# EAGLE design PCB_Grupo_1 (EAGLE 9.6.2)
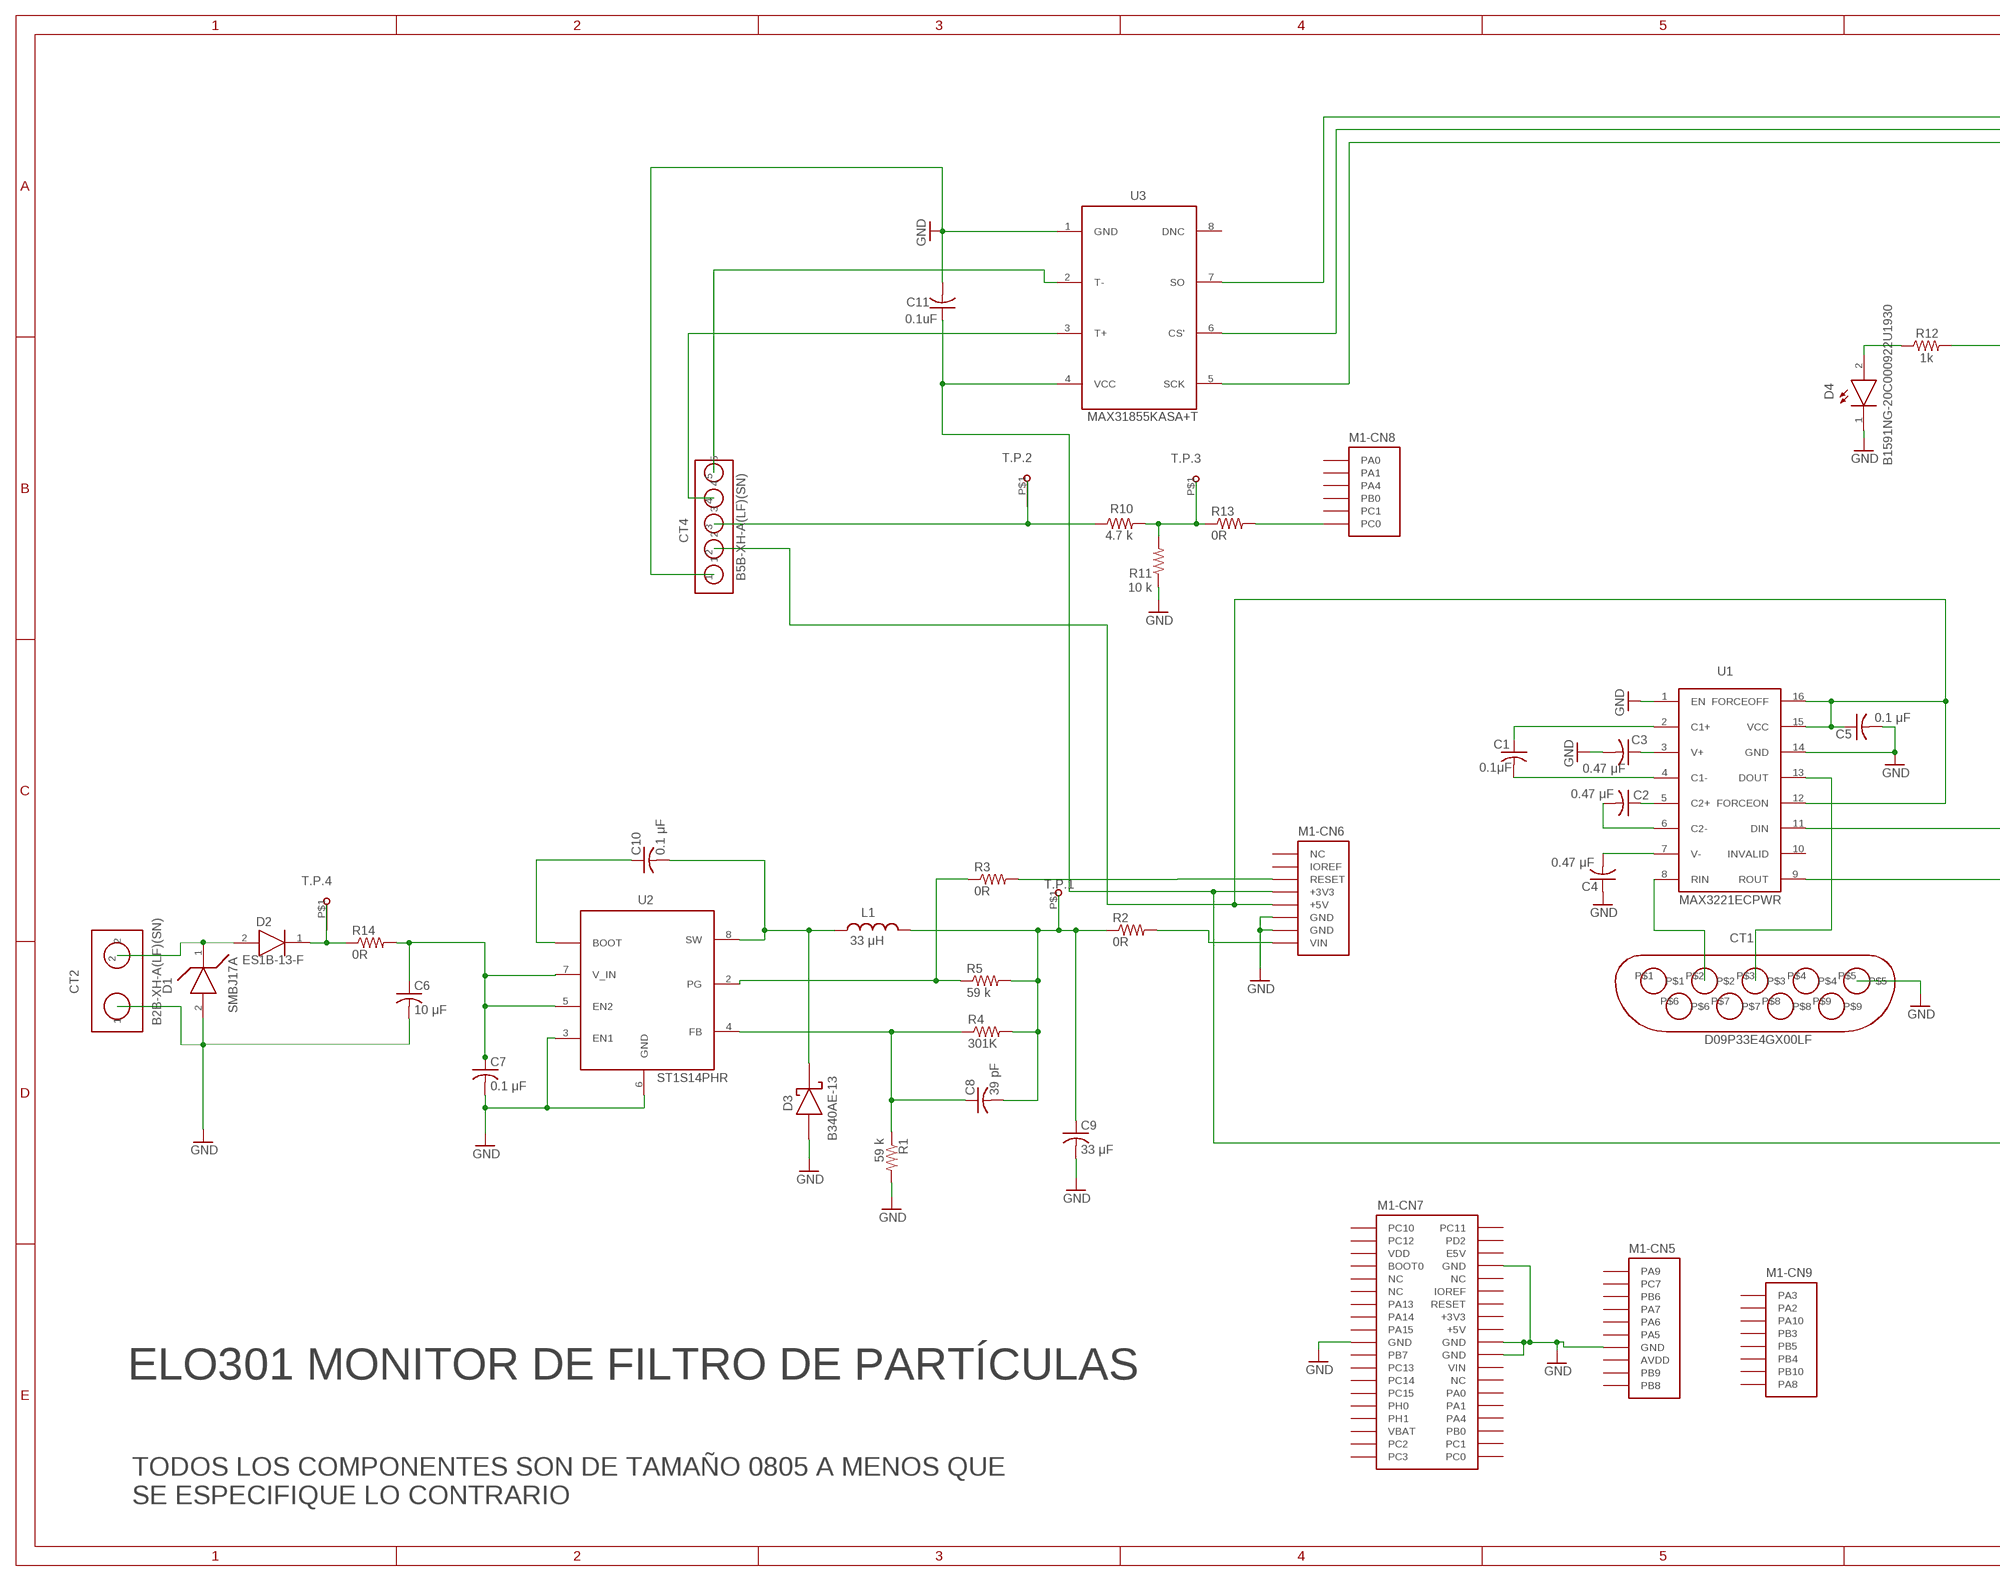
[diagram p0: schematic, sheet 1, part 1 of 2]
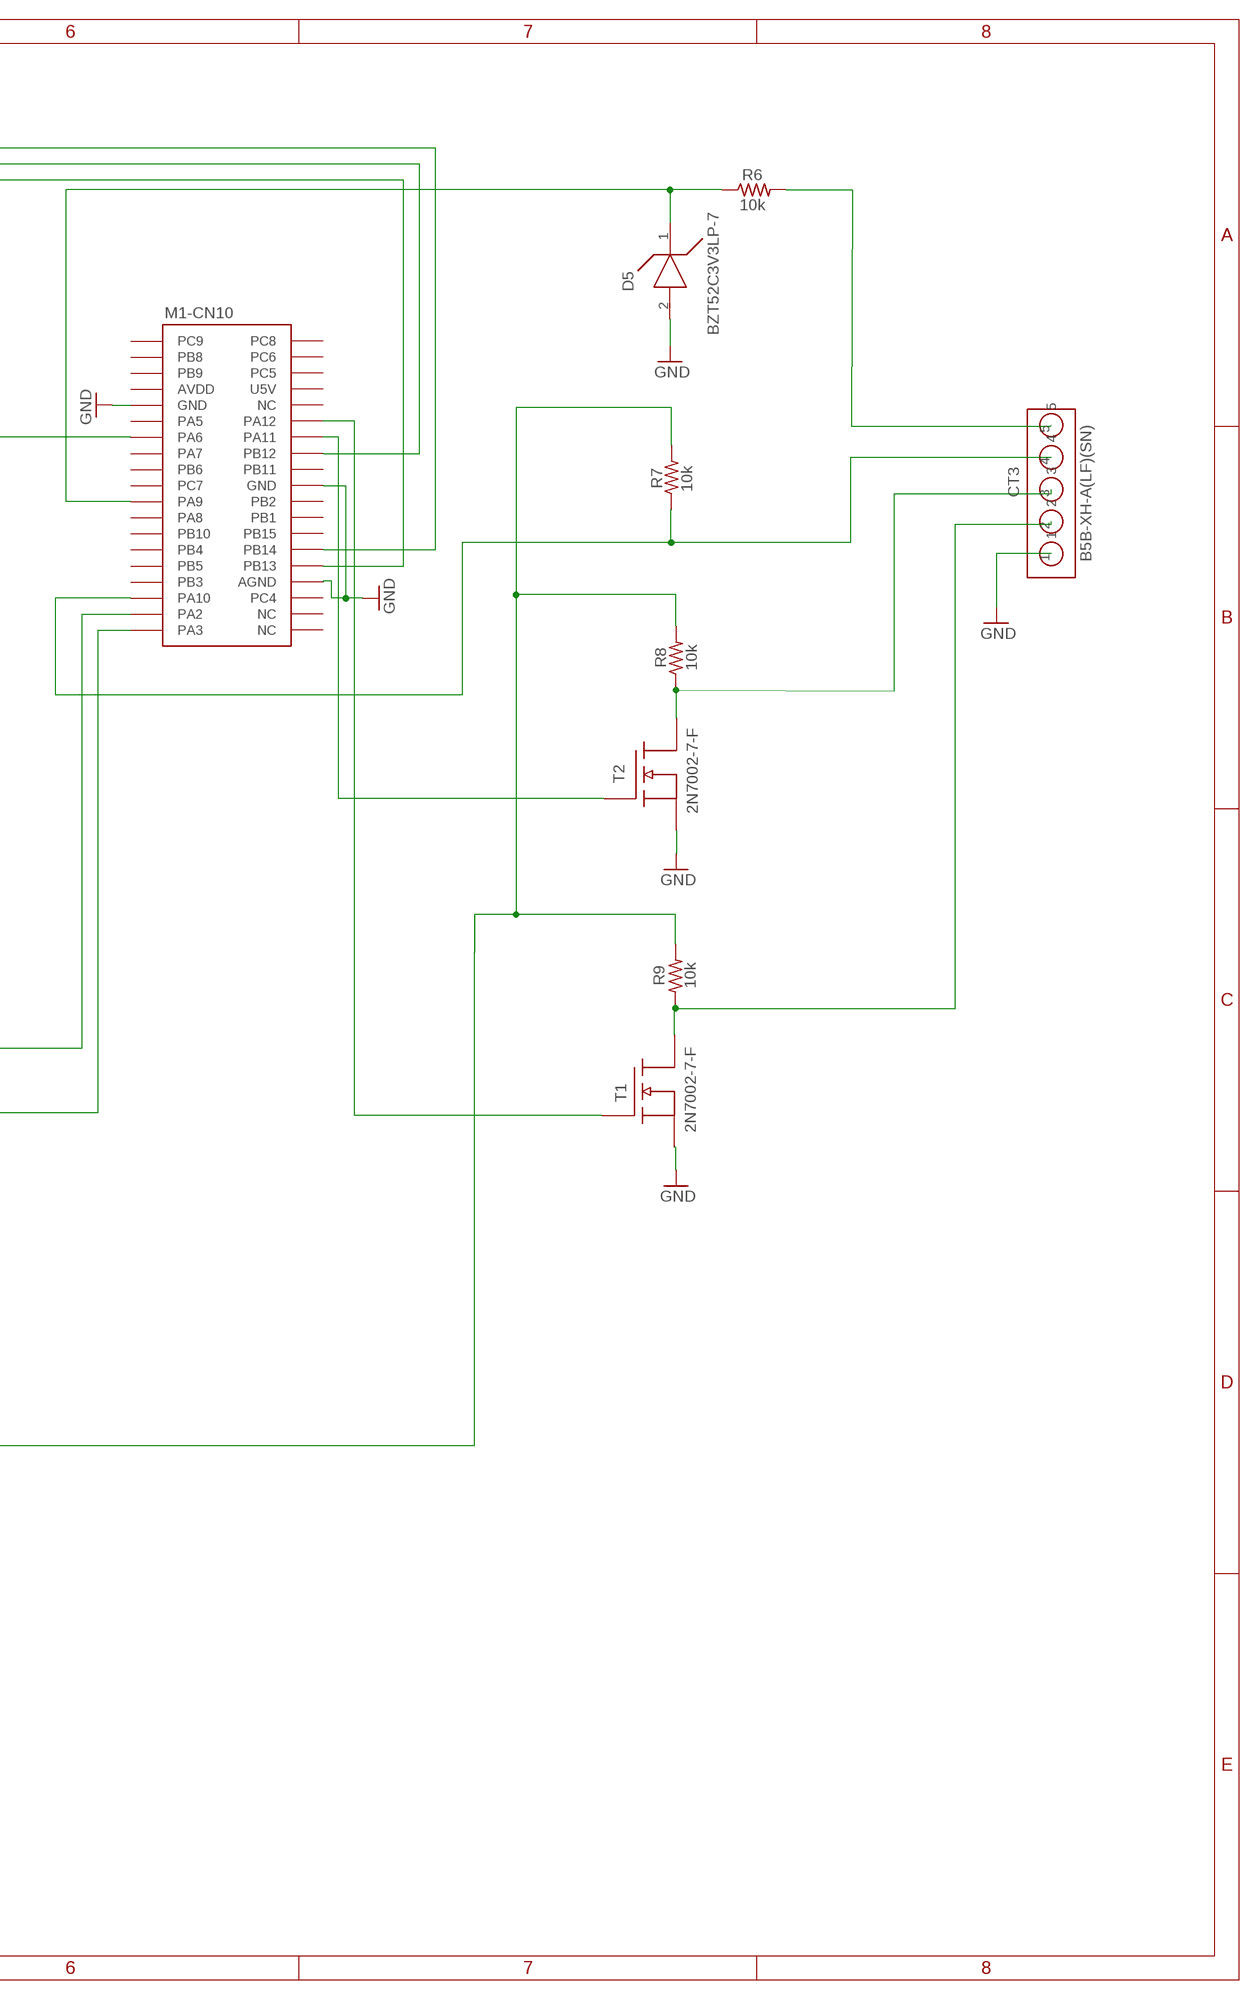
[diagram p1: schematic, sheet 1, part 2 of 2]

## Parts
C1  0.1μF  C-USC0805  [C0805]
C2  0.47 μF  C-USC0805  [C0805]
C3  0.47 μF  C-USC0805  [C0805]
C4  0.47 μF  C-USC0805  [C0805]
C5  0.1 μF  C-USC0805  [C0805]
C6  10 μF  C-USC0805  [C0805]
C7  0.1 μF  C-USC0805  [C0805]
C8  39 pF  C-USC0805  [C0805]
C9  33 μF  C-USC0805  [C0805]
C10  0.1 μF  C-USC0805  [C0805]
C11  0.1uF  C-USC0805  [C0805]
CT1  D09P33E4GX00LF  [JEDEC]
CT2  B2B-XH-A(LF)(SN)  [2-PIN-XH-JST]
CT3  B5B-XH-A(LF)(SN)  [5-PIN-JST]
CT4  B5B-XH-A(LF)(SN)  [5-PIN-JST]
D1  SMBJ17A  [DO-214AA]
D2  ES1B-13-F  [DO-214AC]
D3  B340AE-13  B340AE-13-DI  [DO-214AC]
D4  B1591NG-20C000922U1930  B1591NG--20C000922U1930  [1206(3216METRIC)]
D5  BZT52C3V3LP-7  [0402]
L1  33 μH  LVS606045-330M-N  [SMD]
M1  NUCLEO-L452RE  [NUCLEO-64]
R1  59 k  R-US_R0805  [R0805]
R2  0R  R-US_R0805  [R0805]
R3  0R  R-US_R0805  [R0805]
R4  301K  R-US_R0805  [R0805]
R5  59 k  R-US_R0805  [R0805]
R6  10k  R-US_R0805  [R0805]
R7  10k  R-US_R0805  [R0805]
R8  10k  R-US_R0805  [R0805]
R9  10k  R-US_R0805  [R0805]
R10  4.7 k  R-US_R0805  [R0805]
R11  10 k  R-US_R0805  [R0805]
R12  1k  R-US_R0805  [R0805]
R13  0R  R-US_R0805  [R0805]
R14  0R  R-US_R0805  [R0805]
T1  2N7002-7-F  [TO-236-3]
T2  2N7002-7-F  [TO-236-3]
T.P.1  TEST_POINT  [T.P.]
T.P.2  TEST_POINT  [T.P.]
T.P.3  TEST_POINT  [T.P.]
T.P.4  TEST_POINT  [T.P.]
U1  MAX3221ECPWR  [TSSOP]
U2  ST1S14PHR  [8-SOIC]
U3  MAX31855KASA+T  [8-SOIC]

## Nets
GND: C3.2 C4.1 C5.2 C6.2 C7.2 C9.2 C11.2 CT1.P$5 CT2.1 CT3.1 CT4.1 D1.2(A) D3.2(ANODO) D4.1(C) D5.2(A) M1.CN5-7(-CN5:GND) M1.CN6-6(-CN6:GND) M1.CN6-7(-CN6:GND) M1.CN7-8(-CN7:GND) M1.CN7-19(-CN7:GND) M1.CN7-20(-CN7:GND) M1.CN7-22(-CN7:GND) M1.CN10-9(-CN10:GND) M1.CN10-20(-CN10:GND) M1.CN10-32(-CN10:AGND) R1.2 R11.1 T1.S(SOURCE) T2.S(SOURCE) U1.1(EN) U1.14(GND) U2.3(EN1) U2.6(GND) U3.1(GND)
N$1: C1.1 U1.2(C1+)
N$2: C3.1 U1.3(V+)
N$3: C1.2 U1.4(C1-)
N$4: C2.1 U1.5(C2+)
N$5: C2.2 U1.6(C2-)
N$6: C4.2 U1.7(V-)
N$7: CT1.P$2 U1.8(RIN)
N$8: C5.1 CT4.2 M1.CN6-5(-CN6:+5V) U1.12(FORCEON) U1.15(VCC) U1.16(FORCEOFF)
N$9: CT1.P$3 U1.13(DOUT)
N$10: CT2.2 D1.1(C) D2.2(A)
N$11: C6.1 C7.1 R14.2 U2.5(EN2) U2.7(V_IN)
N$12: C10.1 U2.1(BOOT)
N$13: C10.2 D3.1(CATODO) L1.1 U2.8(SW)
N$14: C8.1 R1.1 R4.1 U2.4(FB)
N$15: C8.2 C9.1 L1.2 R2.1 R4.2 R5.2 T.P.1.P$1(T.P.)
N$16: R3.1 R5.1 U2.2(PG)
N$17: M1.CN6-3(-CN6:RESET) R3.2
N$18: M1.CN6-8(-CN6:VIN) R2.2
N$19: M1.CN10-14(-CN10:PA11) T2.G(GATE)
N$20: CT3.4 M1.CN10-33(-CN10:PA10) R7.1
N$21: M1.CN10-12(-CN10:PA12) T1.G(GATE)
N$22: CT3.5 R6.2
N$23: D5.1(C) M1.CN10-21(-CN10:PA9) R6.1
N$24: CT3.3 R8.1 T2.D(DRAIN)
N$25: D4.2(A) R12.1
N$26: C11.1 M1.CN6-4(-CN6:+3V3) R7.2 R8.2 R9.2 U3.4(VCC)
N$27: CT3.2 R9.1 T1.D(DRAIN)
N$28: CT4.4 U3.3(T+)
N$29: CT4.5 U3.2(T-)
N$30: M1.CN10-28(-CN10:PB14) U3.7(SO)
N$31: M1.CN10-16(-CN10:PB12) U3.6(CS')
N$32: M1.CN10-30(-CN10:PB13) U3.5(SCK)
N$33: M1.CN10-35(-CN10:PA2) U1.11(DIN)
N$34: R10.2 R11.2 R13.1 T.P.3.P$1(T.P.)
N$35: M1.CN10-37(-CN10:PA3) U1.9(ROUT)
N$36: M1.CN10-13(-CN10:PA6) R12.2
N$37: M1.CN8-6(-CN8:PC0) R13.2
N$38: CT4.3 R10.1 T.P.2.P$1(T.P.)
N$39: D2.1(C) R14.1 T.P.4.P$1(T.P.)
Unconnected: CT1.P$1 CT1.P$4 CT1.P$6 CT1.P$7 CT1.P$8 CT1.P$9 M1.CN5-1(-CN5:PA9) M1.CN5-2(-CN5:PC7) M1.CN5-3(-CN5:PB6) M1.CN5-4(-CN5:PA7) M1.CN5-5(-CN5:PA6) M1.CN5-6(-CN5:PA5) M1.CN5-9(-CN5:PB9) M1.CN5-10(-CN5:PB8) M1.CN6-1(-CN6:NC) M1.CN7-1(-CN7:PC10) M1.CN7-2(-CN7:PC11) M1.CN7-3(-CN7:PC12) M1.CN7-4(-CN7:PD2) M1.CN7-6(-CN7:E5V) M1.CN7-7(-CN7:BOOT0) M1.CN7-9(-CN7:NC) M1.CN7-10(-CN7:NC) M1.CN7-11(-CN7:NC) M1.CN7-12(-CN7:IOREF) M1.CN7-13(-CN7:PA13) M1.CN7-14(-CN7:RESET) M1.CN7-15(-CN7:PA14) M1.CN7-17(-CN7:PA15) M1.CN7-21(-CN7:PB7) M1.CN7-23(-CN7:PC13) M1.CN7-25(-CN7:PC14) M1.CN7-26(-CN7:NC) M1.CN7-27(-CN7:PC15) M1.CN7-28(-CN7:PA0) M1.CN7-29(-CN7:PH0) M1.CN7-30(-CN7:PA1) M1.CN7-31(-CN7:PH1) M1.CN7-32(-CN7:PA4) M1.CN7-34(-CN7:PB0) M1.CN7-35(-CN7:PC2) M1.CN7-36(-CN7:PC1) M1.CN7-37(-CN7:PC3) M1.CN7-38(-CN7:PC0) M1.CN8-1(-CN8:PA0) M1.CN8-2(-CN8:PA1) M1.CN8-3(-CN8:PA4) M1.CN8-4(-CN8:PB0) M1.CN8-5(-CN8:PC1) M1.CN9-1(-CN9:PA3) M1.CN9-2(-CN9:PA2) M1.CN9-3(-CN9:PA10) M1.CN9-4(-CN9:PB3) M1.CN9-5(-CN9:PB5) M1.CN9-6(-CN9:PB4) M1.CN9-7(-CN9:PB10) M1.CN9-8(-CN9:PA8) M1.CN10-1(-CN10:PC9) M1.CN10-2(-CN10:PC8) M1.CN10-3(-CN10:PB8) M1.CN10-4(-CN10:PC6) M1.CN10-5(-CN10:PB9) M1.CN10-6(-CN10:PC5) M1.CN10-10(-CN10:NC) M1.CN10-11(-CN10:PA5) M1.CN10-15(-CN10:PA7) M1.CN10-17(-CN10:PB6) M1.CN10-18(-CN10:PB11) M1.CN10-19(-CN10:PC7) M1.CN10-22(-CN10:PB2) M1.CN10-23(-CN10:PA8) M1.CN10-24(-CN10:PB1) M1.CN10-25(-CN10:PB10) M1.CN10-26(-CN10:PB15) M1.CN10-27(-CN10:PB4) M1.CN10-29(-CN10:PB5) M1.CN10-31(-CN10:PB3) M1.CN10-34(-CN10:PC4) M1.CN10-36(-CN10:NC) M1.CN10-38(-CN10:NC) U1.10(INVALID) U3.8(DNC)

## Notes on the sheet
- ELO301 MONITOR DE FILTRO DE PARTÍCULAS
- TODOS LOS COMPONENTES SON DE TAMAÑO 0805 A MENOS QUE 
  SE ESPECIFIQUE LO CONTRARIO

## Power pins joined to a net without a drawn wire
+3V3: M1.CN7-16(-CN7:+3V3)
+5V: M1.CN7-18(-CN7:+5V)
AVDD: M1.CN5-8(-CN5:AVDD) M1.CN10-7(-CN10:AVDD)
IOREF: M1.CN6-2(-CN6:IOREF)
U5V: M1.CN10-8(-CN10:U5V)
VBAT: M1.CN7-33(-CN7:VBAT)
VDD: M1.CN7-5(-CN7:VDD)
VIN: M1.CN7-24(-CN7:VIN)

## Library data of the parts
C1 C5 = rcl:C-US: CAPACITOR, American symbol; PARTNO: GCM21BR72A104KA37L; SPICEPREFIX: C
C2-C4 = rcl:C-US: CAPACITOR, American symbol; PARTNO: GCM21BR71H474KA55L; SPICEPREFIX: C
C6 = rcl:C-US: CAPACITOR, American symbol; PART_NO: GRM21BR61H106KE43L; SPICEPREFIX: C
C7 C10 C11 = rcl:C-US: CAPACITOR, American symbol; PART_NO: GCM21BR72A104KA37L; SPICEPREFIX: C
C8 = rcl:C-US: CAPACITOR, American symbol; PART_NO: GRM21A5C2E390JW01D; SPICEPREFIX: C
C9 = rcl:C-US: CAPACITOR, American symbol; PART_NO: GRM21BR60G336ME15L; SPICEPREFIX: C
CT1 = D09P33E4GX00LF_-_Amphenol_ICC_FCI_1:D09P33E4GX00LF; PART_NO: D09P33E4GX00LF
CT2 = B2B-XH-A(LF)(SN)-JST:B2B-XH-A(LF)(SN); PART_NO: B2B-XH-A(LF)(SN)
CT3 = B5B-XH-A(LF)(SN)-JST:B5B-XH-A(LF)(SN); PARTNO: B5B-XH-A(LF)(SN)
CT4 = B5B-XH-A(LF)(SN)-JST:B5B-XH-A(LF)(SN); PART_NO: B5B-XH-A(LF)(SN)
D1 = SMBJ17A:SMBJ17A; PART_NO: SMBJ17A
D2 = nacha_weaitas:ES1B-13-F; PART_NO: ES1B-13-F
D3 = nacha_weaitas:B340AE-13-DI; PART_NO: B340AE-13
D4 = B1591NG--20C000922U1930:B1591NG--20C000922U1930; PART_NO: B1591NG-20C000922U1930
D5 = SMBJ17A:BZT52C3V3LP-7; PART_NO: BZT52C3V3LP-7
L1 = LVS606045-330M-N - CHILISIN ELECTRONICS CORP:LVS606045-330M-N; PART_NO: LVS606045-330M-N
M1 = NUCLEO-L452RE:NUCLEO-L452RE: No existe un outline (Layer Dimension) para esta librería. En su lugar se utilizó una referencia en tDocu. Al momento de diseñar la tarjeta, el Dimension debe ser dibujado según los requerimientos del usuario, o simplemente copiar los contenidos del tDocu en Dimensions.
R1 R5 = rcl:R-US_: RESISTOR, American symbol; PART_NO: RC0805FR-0759KL; SPICEPREFIX: R
R2 R3 R13 R14 = rcl:R-US_: RESISTOR, American symbol; PART_NO: RC0805JR-070RL; SPICEPREFIX: R
R4 = rcl:R-US_: RESISTOR, American symbol; PARTNO: RC0805FR-07301KL; SPICEPREFIX: R
R6-R9 = rcl:R-US_: RESISTOR, American symbol; PARTNO: Y40227K34000T9W; SPICEPREFIX: R
R10 = rcl:R-US_: RESISTOR, American symbol; PART_NO: RC0805FR-074K7L; SPICEPREFIX: R
R11 = rcl:R-US_: RESISTOR, American symbol; PART_NO: RC0805FR-0710KL; SPICEPREFIX: R
R12 = rcl:R-US_: RESISTOR, American symbol; PART_NO: RC0805FR-071KL; SPICEPREFIX: R
T1 T2 = nacha_weaitas:2N7002-7-F; PART_NO: 2N7002-7-F
T.P.1-T.P.4 = TEST_POINT:TEST_POINT
U1 = MAX3221ECPWR-TI:MAX3221ECPWR; PART_NO: MAX3221ECPWR
U2 = nacha_weaitas:ST1S14PHR; PART_NO: ST1S14PHR
U3 = MAX31855KASA+T- MAXIM INTEGRATED:MAX31855KASA+T; PART_NO: MAX31855KASA+T

## Board
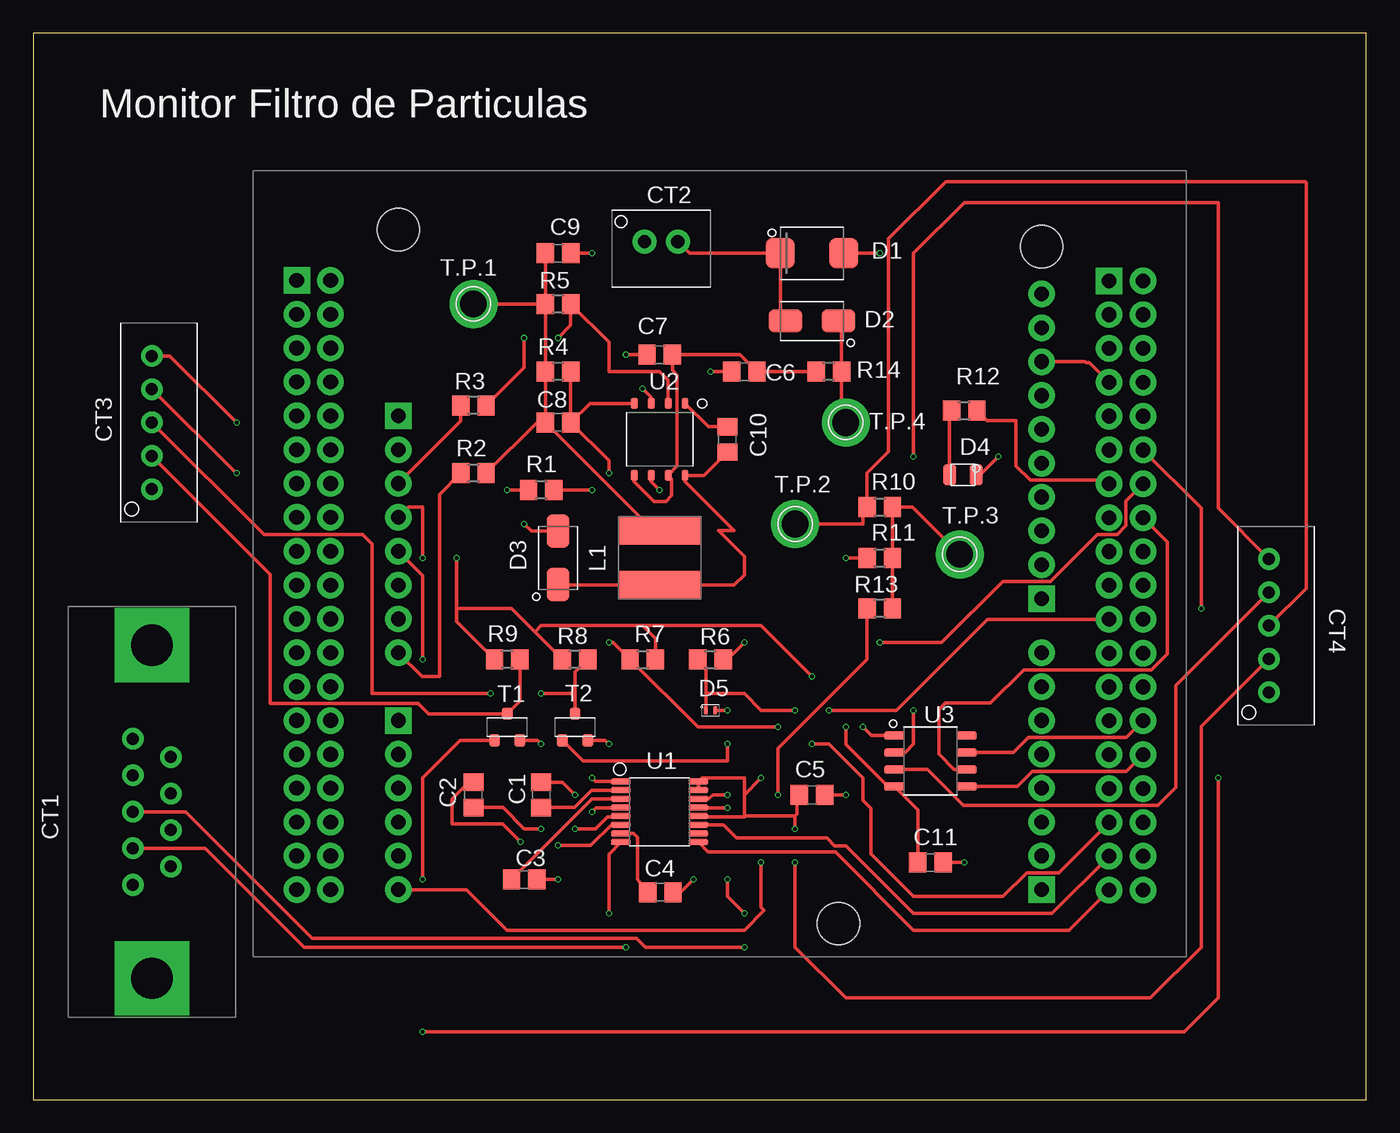
[diagram p2: board, top side]
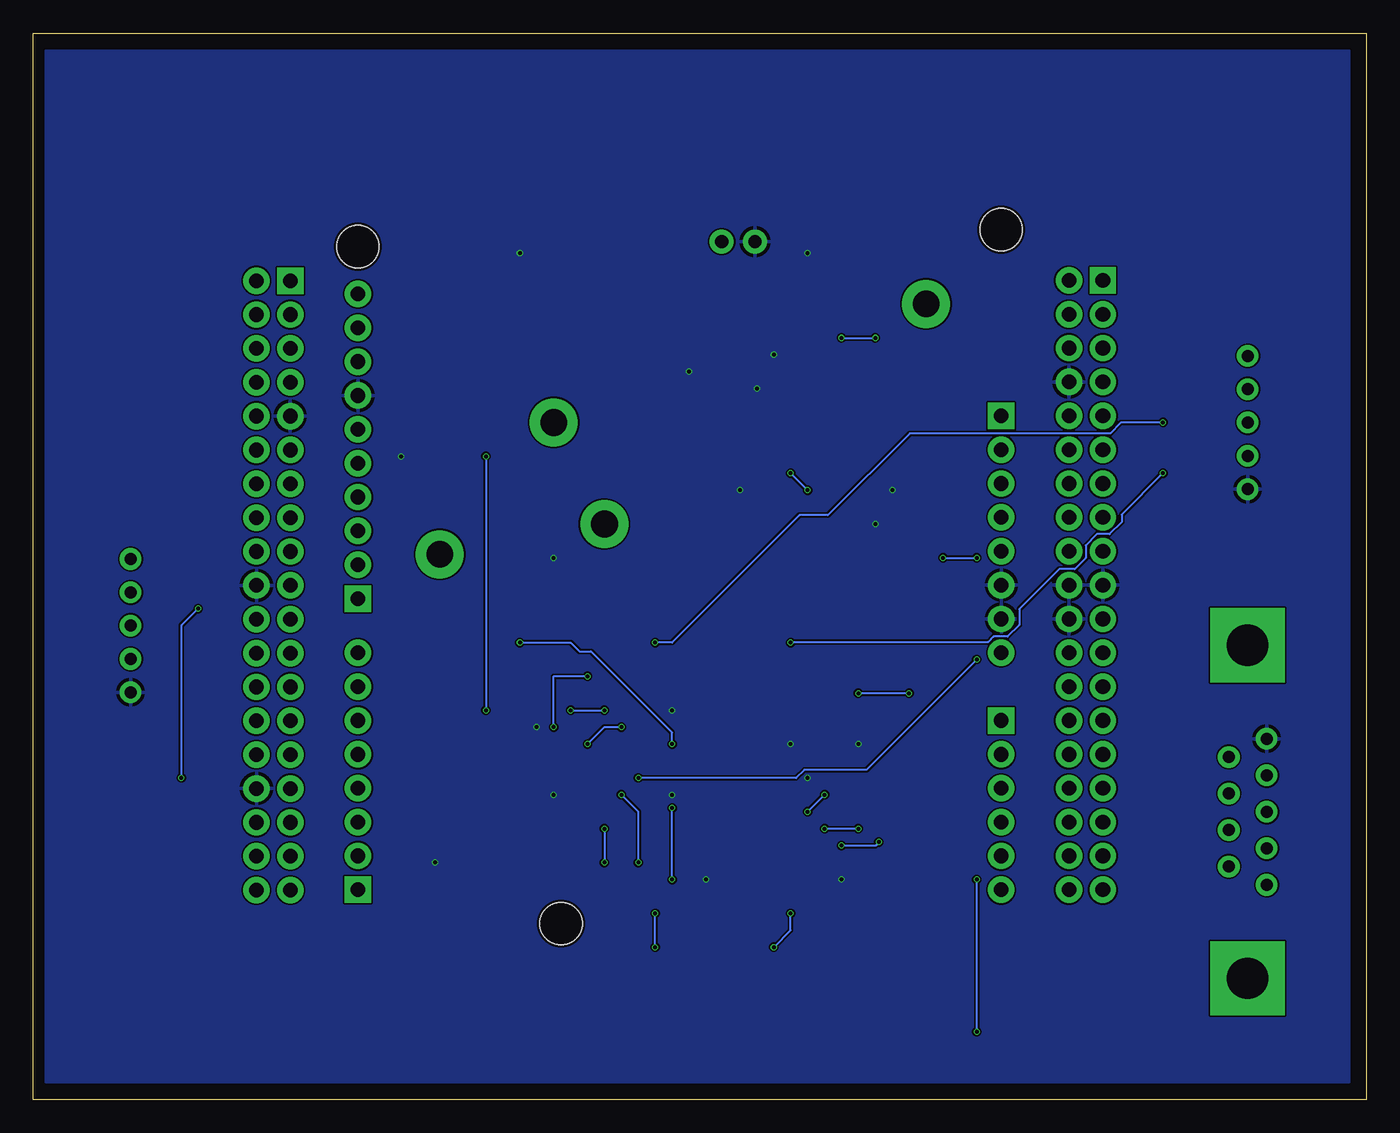
[diagram p3: board, bottom side, seen from below]

Size 100 x 80 mm. Coordinates in mm from the lower left corner, seen from the top.
Outline: 0,0 100,0 100,80 0,80 0,0
Copper layers (1*16): Top 0.035mm / dielectric 1.6mm / Bottom 0.035mm
Design rules "jlcpcb-2layers": minimum track width 5mil, minimum drill 0.3mm, track to track 5mil, track to pad 5mil, pad to pad 5mil, via to via 5mil, smd to smd 5mil, copper to edge 0.2mm, drill to drill 6mil, minimum pad ring 10mil, minimum via ring 3mil, stop-mask expansion 4mil, vias tented up to drill 0mil, thermal gap 10mil

### Footprints (pad centres in the part's own frame; a part is rotated, then mirrored left to right if it is on the bottom)
C0805 = smd 1.3 x 1.5: 1 -0.95,0; 2 0.95,0
JEDEC = drill 0.9: P$1 -5.48,1.42; P$2 -2.74,1.42; P$3 0,1.42; P$4 2.74,1.42; P$5 5.48,1.42; P$6 -4.11,-1.42; P$7 -1.37,-1.42; P$8 1.37,-1.42; P$9 4.11,-1.42 | drill 3.1 square: P$10 12.495,0; P$11 -12.495,0
2-PIN-XH-JST = drill 1: 1 -1.25,0; 2 1.25,0
5-PIN-JST = drill 0.9: 1 -5,0; 2 -2.5,0; 3 0,0; 4 2.5,0; 5 5,0
DO-214AA = smd 2.159 x 2.261: 1 -2.375,0; 2 2.375,0
DO-214AC = smd 2.5 x 1.7: 1 -2,0; 2 2,0
1206(3216METRIC) = smd 1.6 x 1: 1 0,1; 2 0,-1
0402 = smd 0.3 x 0.6: 1 -0.35,0; 2 0.35,0
SMD = smd 6.2 x 2.1: 1 0,2.05; 2 0,-2.05
NUCLEO-64 = drill 1.1 pad 1.85 square: CN5-1 59.13,24.884; CN6-1 10.87,38.6; CN7-1 3.25,48.76; CN8-1 10.87,15.74; CN9-1 59.13,3.04; CN10-1 64.21,48.735 | drill 1.1 pad 1.85: CN5-2 59.13,27.424; CN5-3 59.13,29.964; CN5-4 59.13,32.504; CN5-5 59.13,35.044; CN5-6 59.13,37.584; CN5-7 59.13,40.124; CN5-8 59.13,42.664; CN5-9 59.13,45.204; CN5-10 59.13,47.744; CN6-2 10.87,36.06; CN6-3 10.87,33.52; CN6-4 10.87,30.98; CN6-5 10.87,28.44; CN6-6 10.87,25.9; CN6-7 10.87,23.36; CN6-8 10.87,20.82; CN7-2 5.79,48.76; CN7-3 3.25,46.22; CN7-4 5.79,46.22; CN7-5 3.25,43.68; CN7-6 5.79,43.68; CN7-7 3.25,41.14; CN7-8 5.79,41.14; CN7-9 3.25,38.6; CN7-10 5.79,38.6; CN7-11 3.25,36.06; CN7-12 5.79,36.06; CN7-13 3.25,33.52; CN7-14 5.79,33.52; CN7-15 3.25,30.98; CN7-16 5.79,30.98; CN7-17 3.25,28.44; CN7-18 5.79,28.44; CN7-19 3.25,25.9; CN7-20 5.79,25.9; CN7-21 3.25,23.36; CN7-22 5.79,23.36; CN7-23 3.25,20.82; CN7-24 5.79,20.82; CN7-25 3.25,18.28; CN7-26 5.79,18.28; CN7-27 3.25,15.74; CN7-28 5.79,15.74; CN7-29 3.25,13.2; CN7-30 5.79,13.2; CN7-31 3.25,10.66; CN7-32 5.79,10.66; CN7-33 3.25,8.12; CN7-34 5.79,8.12; CN7-35 3.25,5.58; CN7-36 5.79,5.58; CN7-37 3.25,3.04; CN7-38 5.79,3.04; CN8-2 10.87,13.2; CN8-3 10.87,10.66; CN8-4 10.87,8.12; CN8-5 10.87,5.58; CN8-6 10.87,3.04; CN9-2 59.13,5.58; CN9-3 59.13,8.12; CN9-4 59.13,10.66; CN9-5 59.13,13.2; CN9-6 59.13,15.74; CN9-7 59.13,18.28; CN9-8 59.13,20.82; CN10-2 66.75,48.735; CN10-3 64.21,46.195; CN10-4 66.75,46.195; CN10-5 64.21,43.655; CN10-6 66.75,43.655; CN10-7 64.21,41.115; CN10-8 66.75,41.115; CN10-9 64.21,38.575; CN10-10 66.75,38.575; CN10-11 64.21,36.035; CN10-12 66.75,36.035; CN10-13 64.21,33.495; CN10-14 66.75,33.495; CN10-15 64.21,30.955; CN10-16 66.75,30.955; CN10-17 64.21,28.415; CN10-18 66.75,28.415; CN10-19 64.21,25.875; CN10-20 66.75,25.875; CN10-21 64.21,23.335; CN10-22 66.75,23.335; CN10-23 64.21,20.795; CN10-24 66.75,20.795; CN10-25 64.21,18.255; CN10-26 66.75,18.255; CN10-27 64.21,15.715; CN10-28 66.75,15.715; CN10-29 64.21,13.175; CN10-30 66.75,13.175; CN10-31 64.21,10.635; CN10-32 66.75,10.635; CN10-33 64.21,8.095; CN10-34 66.75,8.095; CN10-35 64.21,5.555; CN10-36 66.75,5.555; CN10-37 64.21,3.015; CN10-38 66.75,3.015 | hole 3.175: 59.13,51.3; 10.87,52.57; 43.89,0.5
R0805 = smd 1.3 x 1.5: 1 -0.95,0; 2 0.95,0
TO-236-3 = smd 0.8 x 0.9: D 0,1; G -0.95,-1; S 0.95,-1
T.P. = drill 2: P$1 0,0
TSSOP = smd 1.5 x 0.45: 1 -2.9,2.275; 2 -2.9,1.625; 3 -2.9,0.975; 4 -2.9,0.325; 5 -2.9,-0.325; 6 -2.9,-0.975; 7 -2.9,-1.625; 8 -2.9,-2.275; 9 2.9,-2.275; 10 2.9,-1.625; 11 2.9,-0.975; 12 2.9,-0.325; 13 2.9,0.325; 14 2.9,0.975; 15 2.9,1.625; 16 2.9,2.275
8-SOIC = smd 0.8 x 0.51: 1 -2.7,1.905; 2 -2.7,0.635; 3 -2.7,-0.635; 4 -2.7,-1.905; 5 2.7,-1.905; 6 2.7,-0.635; 7 2.7,0.635; 8 2.7,1.905
8-SOIC' = smd 1.549 x 0.61: 1 -2.705,1.905; 2 -2.705,0.635; 3 -2.705,-0.635; 4 -2.705,-1.905; 5 2.705,-1.905; 6 2.705,-0.635; 7 2.705,0.635; 8 2.705,1.905

### Placement (x,y rotation side)
C1  38.1,22.86 90 top
C2  33.02,22.86 90 top
C3  36.83,16.51 0 top
C4  47.04,15.55 180 top
C5  58.42,22.86 0 top
C6  53.34,54.61 180 top
C7  46.99,55.88 180 top
C8  39.37,50.8 180 top
C9  39.37,63.5 0 top
C10  52.07,49.53 270 top
C11  67.31,17.78 0 top
CT1  8.89,21.59 90 top
CT2  47.11,64.37 0 top
CT3  8.89,50.8 90 top
CT4  92.71,35.56 90 top
D1  58.42,63.5 0 top
D2  58.42,58.42 180 top
D3  39.37,40.64 90 top
D4  69.74,46.87 270 top
D5  50.8,29.21 0 top
L1  46.99,40.64 180 top
M1  16.51,12.7 0 top
R1  38.1,45.72 180 top
R2  33.02,46.99 180 top
R3  33.02,52.07 180 top
R4  39.37,54.61 180 top
R5  39.37,59.69 180 top
R6  50.8,33.02 0 top
R7  45.72,33.02 0 top
R8  40.64,33.02 180 top
R9  35.56,33.02 180 top
R10  63.5,44.45 0 top
R11  63.5,40.64 0 top
R12  69.85,51.69 0 top
R13  63.5,36.83 180 top
R14  59.69,54.61 180 top
T1  35.56,27.94 0 top
T2  40.64,27.94 0 top
T.P.1  33.02,59.69 180 top
T.P.2  57.15,43.18 0 top
T.P.3  69.51,40.91 0 top
T.P.4  60.96,50.8 180 top
U1  46.99,21.59 0 top
U2  46.99,49.53 270 top
U3  MAX31855KASA+T  [8-SOIC']  67.31,25.4 0 top

### Tracks (layer width: path | path; a pad name or v marks a point on that pad's centre or on a via)
AVDD
  Top 0.254: M1.CN5-8 78.89,55.36 78.96,55.3 79.24,55.3 M1.CN10-7
GND  (via drill 0.3)
  Top 0.254: C9.2 v41.91,63.5 | C7.2 v44.45,55.88 | C6.2 v50.8,54.61 | v63.5,63.5 D1.2 | U2.6 46.35,46.35 v46.99,45.72 | R1.2 v35.56,45.72 | U2.3 46.35,52.7 v45.72,53.34 | D3.2 37.37,42.64 v36.83,43.18 | D4.1 71,46.87 v72.39,48.26 | R11.1 v60.96,40.64 | U3.1 62.87,27.3 v62.23,27.94 | C11.2 v69.85,17.78 | v60.96,22.86 C5.2 | U1.14 49.91,22.54 50.66,22.54 50.98,22.86 v52.07,22.86 | D5.2 v52.07,29.21 | U1.1 42.17,23.86 v41.91,24.13 | T2.S 42.91,26.94 v43.18,26.67 | T1.S 37.83,26.94 v38.1,26.67 | v39.37,16.51 C3.2 | C4.1 48.57,15.55 v49.53,16.51
  pour Bottom: 1.27,1.27 99.06,1.27 99.06,78.74 1.27,78.74
N$1
  Top 0.254: C1.1 40.62,21.91 41.9,23.19 44.06,23.19 U1.2
N$2
  Top 0.254: C3.1 41.94,22.57 U1.3
N$3  (via drill 0.3)
  Top 0.254: C1.2 39.69,23.81 v40.64,22.86 | v41.91,21.59 42.21,21.89 42.96,21.89 42.94,21.87 44.04,21.87 U1.4
  Bottom 0.152: v40.64,22.86 v41.91,21.59
N$4  (via drill 0.3)
  Top 0.254: C2.1 35.24,21.91 36.83,20.32 v38.1,20.32 | U1.5 44.03,21.21 43.08,21.21 42.19,20.32 v40.64,20.32
  Bottom 0.152: v38.1,20.32 v40.64,20.32
N$5  (via drill 0.3)
  Top 0.254: C2.2 32.65,23.81 31.41,22.57 31.41,20.68 35.2,20.68 v36.56,19.32 | U1.6 44.07,20.64 43.4,20.64 41.82,19.06 v39.37,19.06
  Bottom 0.152: v36.56,19.32 36.83,19.05 v39.37,19.05 v39.37,19.06
N$6
  Top 0.254: C4.2 45.33,16.52 45.33,19.67 45.03,19.96 U1.7
N$7  (via drill 0.3)
  Top 0.254: CT1.P$2 12.9,18.85 20.32,11.43 v44.45,11.43 | v43.18,13.97 43.18,18.41 U1.8
  Bottom 0.152: v44.45,11.43 43.18,12.7 v43.18,13.97
N$8  (via drill 0.3)
  Top 0.254: C5.1 57.31,22.7 57.31,21.43 57.15,21.27 | 57.15,21.27 53.34,21.27 | U1.12 49.95,21.2 53.34,21.2 53.34,21.27 | 53.34,21.27 53.34,22.86 | 53.34,22.86 53.34,24.13 50.16,24.13 U1.16 U1.15 | CT4.2 87.63,27.98 87.63,11.43 83.82,7.62 60.96,7.62 57.15,11.43 v57.15,17.78 | v57.15,20.32 57.15,21.26 57.15,21.27 | M1.CN6-5 29.21,39.31 v29.21,33.02 | v54.61,24.13 53.34,22.86
  Bottom 0.152: v57.15,20.32 v57.15,17.78 | v54.61,24.13 42.77,24.13 42.16,24.74 37.49,24.74 v29.21,33.02
N$9  (via drill 0.3)
  Top 0.254: CT1.P$3 11.43,21.59 20.91,12.11 45.24,12.11 45.92,11.43 v53.34,11.43 | v53.34,13.97 52.07,15.24 v52.07,16.51 | v52.07,21.87 49.93,21.87 U1.13
  Bottom 0.152: v53.34,11.43 v53.34,13.97 | v52.07,16.51 v52.07,21.87
N$10
  Top 0.254: CT2.2 49.23,63.5 D1.1 56.05,58.8 D2.2
N$11
  Top 0.254: R14.2 C6.1 53.02,55.88 C7.1 47.94,54.74 48.31,54.37 48.31,47.51 U2.7 47.9,46.56 47.9,45.31 47.46,44.87 46.57,44.87 45.09,46.35 U2.5
N$12
  Top 0.254: C10.1 50.65,50.48 U2.1
N$13
  Top 0.254: C10.2 50.32,46.83 U2.8 48.9,46.35 52.55,42.7 51.39,42.7 53.34,40.75 53.34,39.37 52.56,38.59 L1.1 39.42,38.59 D3.1
N$14  (via drill 0.3)
  Top 0.254: C8.1 41.75,52.23 U2.4 | C8.1 43.18,47.94 v43.18,46.99 | v41.91,45.72 R1.1 | C8.1 R4.1
  Bottom 0.152: v43.18,46.99 v41.91,45.72
N$15
  Top 0.254: R5.2 T.P.1.P$1 | C9.1 R5.2 | R5.2 R4.2 C8.2 | R2.1 37.78,50.8 C8.2 | C8.2 46.53,42.69 L1.2
N$16  (via drill 0.3)
  Top 0.254: U2.2 47.62,53.98 46.99,54.61 43.18,54.61 43.18,56.83 R5.1 40.32,58.1 v39.37,57.15 | v36.83,57.15 36.83,54.93 R3.1
  Bottom 0.152: v39.37,57.15 v36.83,57.15
N$17
  Top 0.254: R3.2 32.07,50.91 M1.CN6-3
N$18
  Top 0.254: R2.2 30.48,45.4 30.48,31.75 29.15,31.75 M1.CN6-8
N$19  (via drill 0.3)
  Top 0.254: T2.G 41.23,25.4 52.07,25.4 v52.07,26.67 | v63.5,34.29 68.15,34.29 72.73,38.87 76.32,38.87 79.84,42.39 81.32,42.39 81.98,43.06 81.98,44.92 M1.CN10-14
  Bottom 0.152: v63.5,34.29 59.69,34.29 59.03,33.63 58.17,33.63 52.07,27.53 v52.07,26.67
N$20  (via drill 0.3)
  Top 0.254: v58.42,26.67 59.69,26.67 62.23,24.13 62.23,22.45 62.84,21.84 62.84,18.44 66.04,15.24 72.75,15.24 74.53,17.01 76.94,17.01 M1.CN10-33 | v55.88,27.94 49.85,27.94 R7.1 43.5,34.29 v43.18,34.29 | CT3.4 15.2,46.99 v15.24,46.99
  Bottom 0.152: v58.42,26.67 57.15,27.94 v55.88,27.94 | v15.24,46.99 18.35,43.88 18.35,43.32 19.25,42.41 20.21,42.41 21.04,41.59 21.04,40.64 21.88,39.8 23.03,39.8 26.04,36.8 26.04,35.62 26.91,34.74 27.97,34.74 28.36,34.35 43.12,34.35 v43.18,34.29
N$21  (via drill 0.3)
  Top 0.254: M1.CN10-12 87.63,44.37 v87.63,36.83 | v88.9,24.13 88.9,7.62 86.36,5.08 v29.21,5.08 | v29.21,16.51 29.21,24.13 32.02,26.94 T1.G
  Bottom 0.152: v87.63,36.83 88.9,35.56 v88.9,24.13 | v29.21,5.08 v29.21,16.51
N$22  (via drill 0.3)
  Top 0.254: CT3.5 10.24,55.8 v15.24,50.8 | v53.34,34.29 52.07,33.02 R6.2
  Bottom 0.152: v15.24,50.8 18.39,50.8 19.2,49.99 34.24,49.99 40.39,43.84 42.52,43.84 52.07,34.29 v53.34,34.29
N$23  (via drill 0.3)
  Top 0.254: D5.1 50.45,30.48 | 50.45,30.48 50.45,32.42 R6.1 | M1.CN10-21 71.59,36.03 64.77,29.21 v59.69,29.21 | v57.15,29.21 54.61,29.21 53.34,30.48 50.45,30.48
  Bottom 0.152: v59.69,29.21 v57.15,29.21
N$24  (via drill 0.3)
  Top 0.254: T2.D 40.64,30.48 | 40.64,30.48 40.64,32.07 R8.1 | v34.29,30.48 25.4,30.48 25.4,41.68 24.69,42.39 17.3,42.39 CT3.3 | v38.1,30.48 40.64,30.48
  Bottom 0.152: v34.29,30.48 v38.1,30.48
N$25
  Top 0.254: R12.1 68.74,51.53 D4.2
N$26  (via drill 0.3)
  Top 0.254: C11.1 66.36,21.74 U3.4 64.42,23.68 63.92,23.68 60.96,26.65 v60.96,27.94 | R9.2 31.75,35.88 31.75,36.83 | 31.75,36.83 v31.75,40.64 | v29.21,40.64 29.21,44.45 28.15,44.45 M1.CN6-4 | R8.2 37.62,35.09 | 37.62,35.09 35.88,36.83 31.75,36.83 | R7.2 46.67,34.61 45.72,35.56 | 45.72,35.56 38.1,35.56 37.62,35.09 | v58.42,31.75 54.61,35.56 45.72,35.56
  Bottom 0.152: v31.75,40.64 v29.21,40.64 | v60.96,27.94 60.96,31.75 v58.42,31.75
N$27
  Top 0.254: R9.1 36.51,29.89 T1.D 29.66,28.94 28.88,29.71 17.78,29.71 17.78,39.41 CT3.2
N$28
  Top 0.254: U3.3 67.1,24.77 69.78,22.08 84.38,22.08 85.71,23.41 85.71,31.06 CT4.4
N$29  (via drill 0.3)
  Top 0.254: CT4.5 88.9,44.37 88.9,67.31 69.85,67.31 66.04,63.5 v66.04,48.26 | v66.04,29.21 v66.05,29.2 66.05,26.67 65.42,26.04 U3.2
  Bottom 0.152: v66.04,48.26 v66.04,29.21
N$30
  Top 0.254: U3.7 73.53,26.04 74.66,27.16 82.01,27.16 M1.CN10-28
N$31
  Top 0.254: M1.CN10-16 85.08,41.84 85.08,33.44 83.88,32.23 74.3,32.23 71.82,29.75 68.45,29.75 68.43,29.77 67.92,29.27 67.92,25.91 69.08,24.77 U3.6
N$32
  Top 0.254: U3.5 73.84,23.5 74.96,24.61 82,24.61 M1.CN10-30
N$33
  Top 0.254: U1.11 51.77,20.61 52.77,19.62 59.55,19.62 60.12,19.05 60.96,19.05 66.04,13.97 76.44,13.97 M1.CN10-35
N$34
  Top 0.254: T.P.3.P$1 65.97,44.45 R10.2 R11.2 R13.1
N$35
  Top 0.254: U1.9 50.63,18.57 60.16,18.57 66.04,12.7 77.7,12.7 M1.CN10-37
N$36
  Top 0.254: R12.2 71.54,50.95 73.73,50.95 73.73,47.53 74.79,46.47 80.45,46.47 M1.CN10-13
N$37  (via drill 0.3)
  Top 0.254: M1.CN8-6 32.52,15.74 35.56,12.7 53.34,12.7 54.83,14.19 54.61,14.41 v54.61,17.78 | v55.88,22.86 55.88,26.35 62.55,33.02 R13.2
  Bottom 0.152: v54.61,17.78 54.61,21.59 v55.88,22.86
N$38
  Top 0.254: T.P.2.P$1 62.23,43.18 62.23,44.13 R10.1 62.55,46.99 64.16,48.6 64.16,64.59 68.45,68.89 95.42,68.89 95.51,68.79 95.51,38.36 CT4.3
N$39
  Top 0.254: D2.1 60.64,58.2 R14.1 60.64,51.12 T.P.4.P$1

### Text on the board
tPlace: Monitor Filtro de Particulas